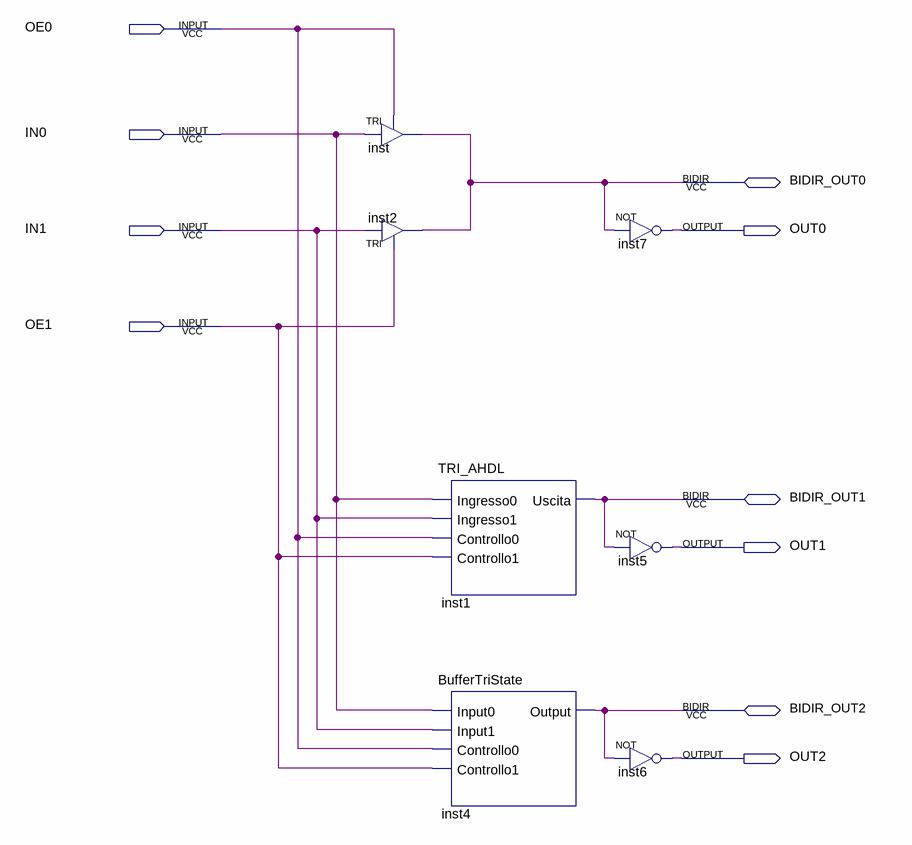
[diagram p0: schematic sheet]
// Quartus schematic TriState_Buffer.bdf as structural Verilog: 7 symbols, 10 pins
module TriState_Buffer (
  input  OE0,
  input  IN0,
  input  IN1,
  input  OE1,
  inout  BIDIR_OUT0,
  inout  BIDIR_OUT1,
  inout  BIDIR_OUT2,
  output OUT0,
  output OUT1,
  output OUT2
);

  TRI inst (.IN(IN0), .OE(OE0), .OUT(BIDIR_OUT0));
  TRI inst2 (.IN(IN1), .OE(OE1), .OUT(BIDIR_OUT0));
  TRI_AHDL inst1 (.Ingresso0(IN0), .Ingresso1(IN1), .Controllo0(OE0), .Controllo1(OE1), .Uscita(BIDIR_OUT1));
  BufferTriState inst4 (.Input0(IN0), .Input1(IN1), .Controllo0(OE0), .Controllo1(OE1), .Output(BIDIR_OUT2));
  not inst7 (OUT0, BIDIR_OUT0);
  not inst5 (OUT1, BIDIR_OUT1);
  not inst6 (OUT2, BIDIR_OUT2);
endmodule
